# EasyEDA Pro project OSC1.eprj, schematic 主板电路

## Sheets
1 主板和AD: Create Date: 2024-10-10; Page Name: 主板和AD; Project Name: OSC1; Schematic Name: 主板电路; Update Date: 2024-10-10; Company: 嘉立创EDA; Page Size: A4; Version: V1.0
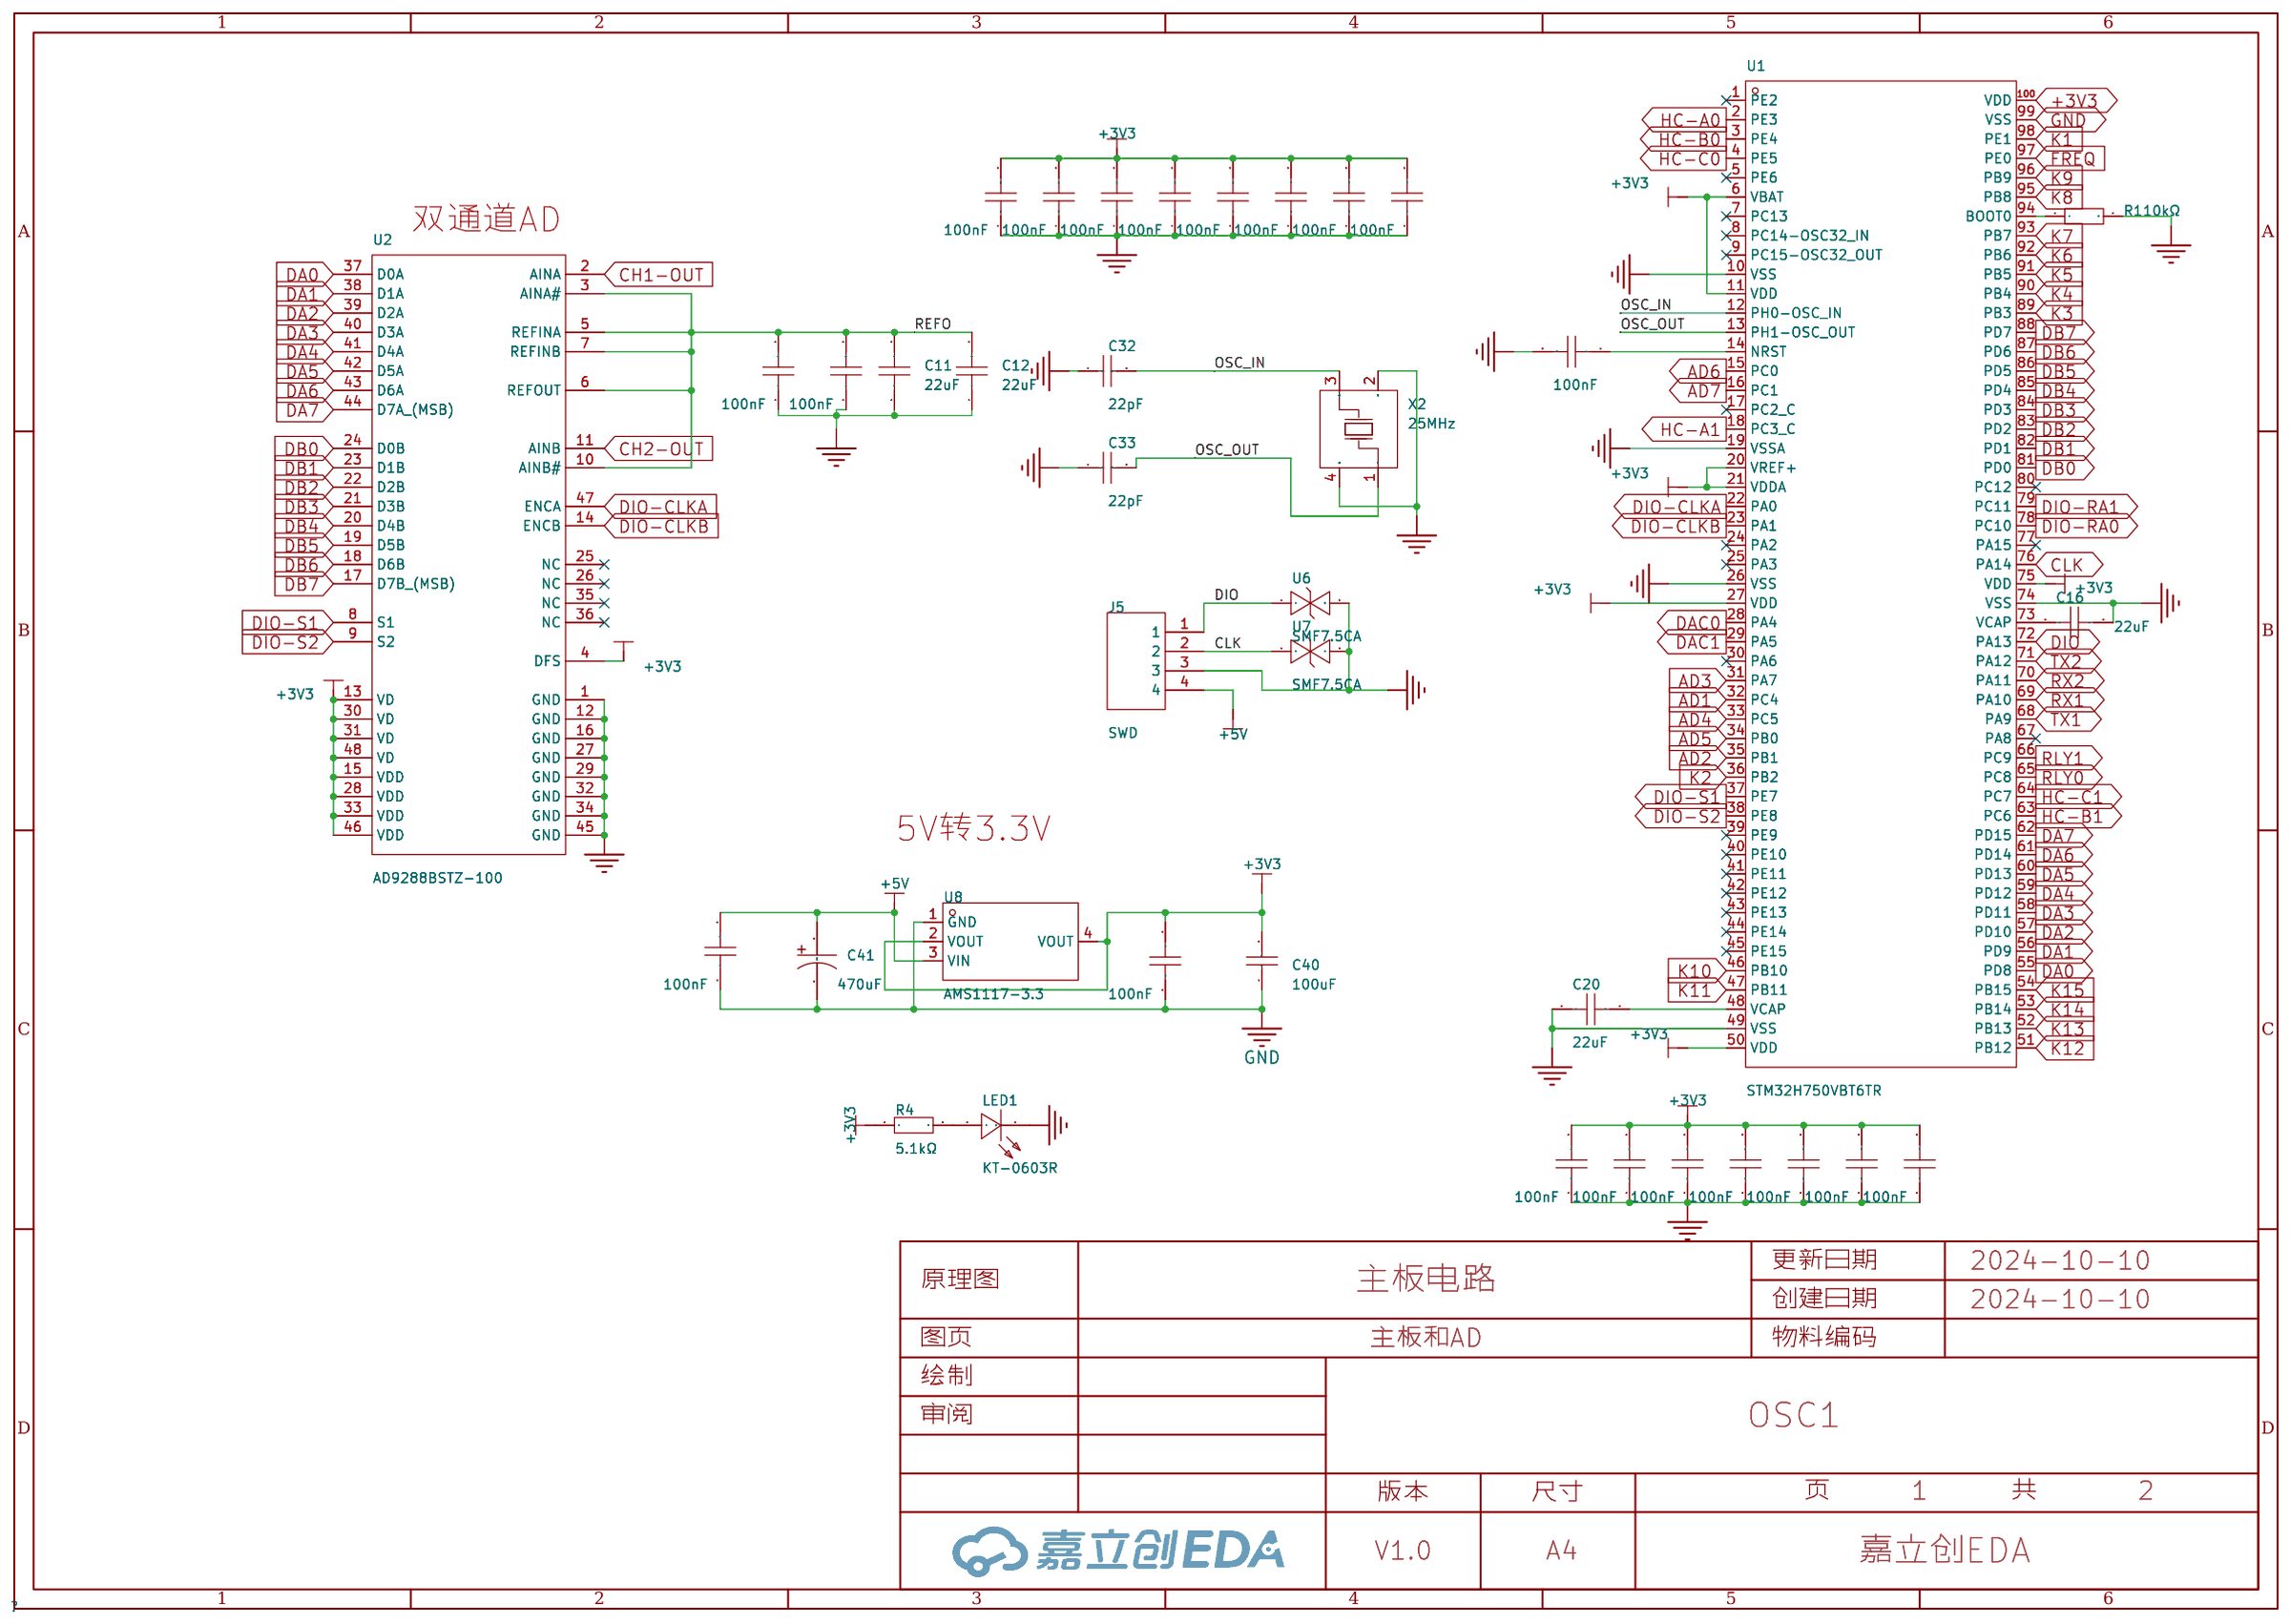
[diagram p4: 主板和AD]
2 插排: Page Name: 插排
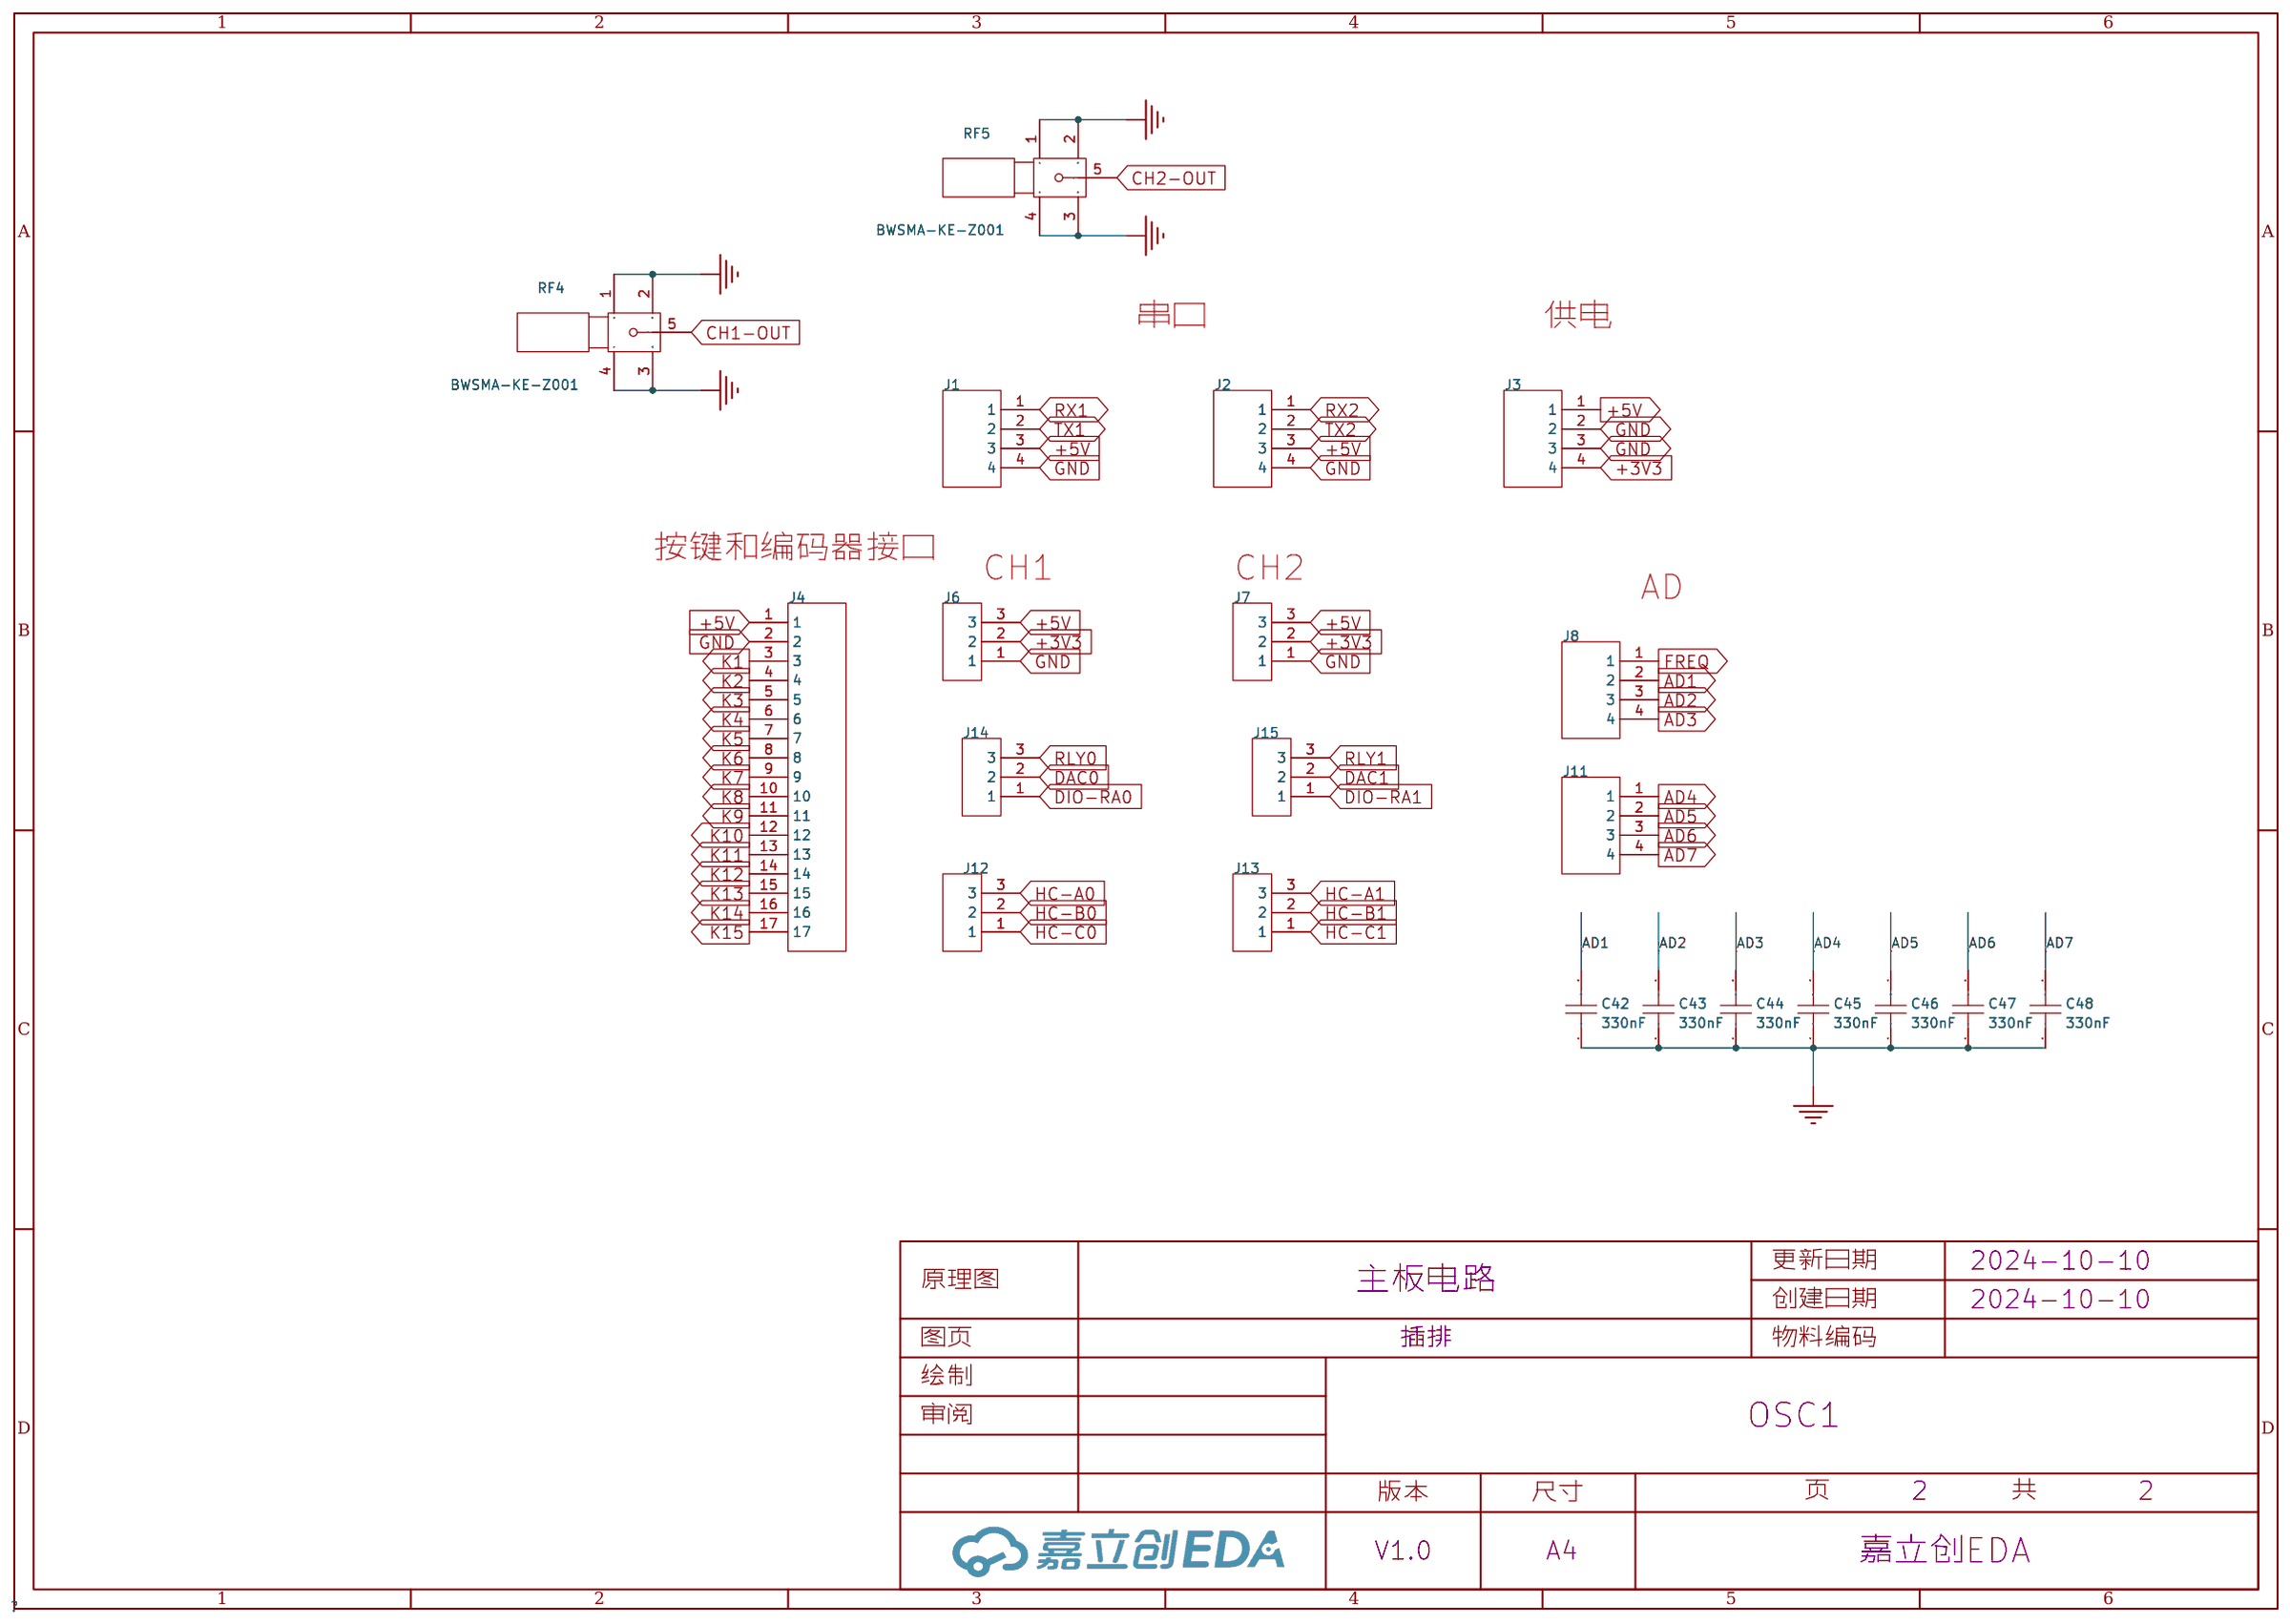
[diagram p5: 插排]

## Parts
sheet 主板和AD
C1  100nF  [C0402]
C2  100nF  [C0402]
C3  100nF  [C0402]
C4  100nF  [C0402]
C5  100nF  [C0402]
C6  100nF  [C0402]
C7  100nF  [C0402]
C8  100nF  [C0402]
C11  22uF  [C0603]
C12  22uF  [C0603]
C14  100nF  [C0402]
C16  22uF  [C0603]
C20  22uF  [C0603]
C21  100nF  [C0402]
C22  100nF  [C0402]
C23  100nF  [C0402]
C24  100nF  [C0402]
C25  100nF  [C0402]
C26  100nF  [C0402]
C27  100nF  [C0402]
C28  100nF  [C0402]
C29  100nF  [C0402]
C32  22pF  [C0603]
C33  22pF  [C0603]
C38  100nF  [C0402]
C39  100nF  [C0402]
C40  100uF  [C1206]
C41  470uF  [CAP-TH_BD8.0-P3.50-D0.6-FD_1]
J5  SWD  [CH2.54-4插座]
LED1  KT-0603R  [LED0603-RD]
R1  10kΩ  [R0402]
R4  5.1kΩ  [R0603]
U1  STM32H750VBT6TR  [QFP-100_L14.0-W14.0-P0.50-LS16.0-BL]
U2  AD9288BSTZ-100  [LQFP-48_L7.0-W7.0-P0.50-LS9.0-BL]
U6  SMF7.5CA  [SOD-123FL_L2.8-W1.8-LS3.7-BI]
U7  SMF7.5CA  [SOD-123FL_L2.8-W1.8-LS3.7-BI]
U8  AMS1117-3.3  [SOT-223-3_L6.5-W3.4-P2.30-LS7.0-BR]
X2  25MHz  [OSC-SMD_4P-L3.2-W2.5-BL]
sheet 插排
C42  330nF  [C0603]
C43  330nF  [C0603]
C44  330nF  [C0603]
C45  330nF  [C0603]
C46  330nF  [C0603]
C47  330nF  [C0603]
C48  330nF  [C0603]
J1  -  [CH2.54-4插座]
J2  -  [CH2.54-4插座]
J3  -  [CH2.54-4插座]
J4  -  [CH2.54-17P]
J6  -  [CH2.54-3插座]
J7  -  [CH2.54-3插座]
J8  -  [CH2.54-4插座]
J11  -  [CH2.54-4插座]
J12  -  [CH2.54-3插座]
J13  -  [CH2.54-3插座]
J14  -  [CH2.54-3插座]
J15  -  [CH2.54-3插座]
RF4  BWSMA-KE-Z001  [SMA-TH_BWSMA-KE-Z001]
RF5  BWSMA-KE-Z001  [SMA-TH_BWSMA-KE-Z001]

## Library data of the parts
C1-C8 C14 C21-C29 C38 C39 = CL05B104KB54PNC: 容值:100nF;精度:±10%;额定电压:50V;材质(温度系数):X7R;; LCSC Part Name: 100nF ±10% 50V; Supplier Part: C307331; Manufacturer: SAMSUNG(三星); Supplier Footprint: 0402; JLCPCB Part Class: 基础库; Datasheet: https://atta.szlcsc.com/upload/public/pdf/source/20160218/1457707763339.pdf; Supplier: LCSC; Tolerance: ±10%; Voltage Rated: 50V; Temperature Coefficient: X7R
C11 C12 C16 C20 = CL10A226MQ8NRNC: 容值:22uF;精度:±20%;额定电压:6.3V;材质(温度系数):X5R;; LCSC Part Name: 22uF ±20% 6.3V; Supplier Part: C59461; Manufacturer: SAMSUNG(三星); Supplier Footprint: 0603; Datasheet: https://atta.szlcsc.com/upload/public/pdf/source/20160218/1457707763339.pdf; Supplier: LCSC; Tolerance: ±20%; Voltage Rated: 6.3V; Temperature Coefficient: X5R
C32 C33 = CL10C220JB8NNNC: 容值:22pF;精度:±5%;额定电压:50V;材质(温度系数):C0G;; LCSC Part Name: 22pF ±5% 50V; Supplier Part: C1653; Manufacturer: SAMSUNG(三星); Supplier Footprint: 0603; JLCPCB Part Class: 基础库; Datasheet: https://atta.szlcsc.com/upload/public/pdf/source/20160218/1457707763339.pdf; Supplier: LCSC; Tolerance: ±5%; Voltage Rated: 50V; Temperature Coefficient: C0G
C40 = CL31A107MQHNNNE: 容值:100uF;精度:±20%;额定电压:6.3V;材质(温度系数):X5R;; LCSC Part Name: 100uF ±20% 6.3V; Supplier Part: C15008; Manufacturer: SAMSUNG(三星); Supplier Footprint: 1206; Datasheet: https://atta.szlcsc.com/upload/public/pdf/source/20160218/1457707763339.pdf; Supplier: LCSC; Tolerance: ±20%; Voltage Rated: 6.3V; Temperature Coefficient: X5R
C41 = RVT1A471M0607_C335982: 容值:470uF;精度:±20%;额定电压:10V;纹波电流:200mA@120Hz;等效串联电阻:-;; LCSC Part Name: 470uF ±20% 10V; Supplier Part: C335982; Manufacturer: ROQANG(容强); Manufacturer Part: RVT1A471M0607; Supplier Footprint: SMD,D6.3xL7.7mm; Datasheet: https://atta.szlcsc.com/upload/public/pdf/source/20181128/C335987_23CA7AA50FB42690DF736C43FE112376.pdf; Supplier: LCSC; Tolerance: ±20%; Rated Voltage: 10V; Ripple Current: 200mA@120Hz; φD: 6.3mm; L: 7.7mm; Lifetime @ Temp: 2000hrs@105℃; Operating Temperature: -40℃~+105℃
J1-J3 J5 J8 J11 = HDR-4P
LED1 = KT-0603R: 发光颜色:红色;功率:-;正向电流:-;主波长:-;二极管配置:-;透镜颜色:-;色温:-;发光角度:-;载带方式:-;工作温度:-40℃~+85℃;; LCSC Part Name: 0603 红灯 高亮; Supplier Part: C2286; Manufacturer: KENTO; Supplier Footprint: 0603; Datasheet: https://atta.szlcsc.com/upload/public/pdf/source/20160616/1466072038404.pdf; Supplier: LCSC; Emitted Color: 红色; Operating Temperature: -40℃~+85℃
R1 = 0402WGF1002TCE: 电阻类型:厚膜电阻;阻值:10kΩ;精度:±1%;功率:62.5mW;最大工作电压:50V;温度系数:±100ppm/℃;; LCSC Part Name: 10kΩ ±1% 62.5mW 厚膜电阻; Supplier Part: C25744; Manufacturer: UNI-ROYAL(厚声); Supplier Footprint: 0402; JLCPCB Part Class: 基础库; Datasheet: https://atta.szlcsc.com/upload/public/pdf/source/20200306/C422600_1E6D84923E4A46A82E41ADD87F860B5C.pdf; Supplier: LCSC; Type: 厚膜电阻; Tolerance: ±1%; Power(Watts): 62.5mW; Overload Voltage (Max): 50V; Temperature Coefficient: ±100ppm/℃; Operating Temperature Range: -55℃~+155℃
R4 = 0603WAF5101T5E: 电阻类型:厚膜电阻;阻值:5.1kΩ;精度:±1%;功率:100mW;最大工作电压:75V;温度系数:±100ppm/℃;; LCSC Part Name: 5.1kΩ ±1% 100mW 厚膜电阻; Supplier Part: C23186; Manufacturer: UNI-ROYAL(厚声); Supplier Footprint: 0603; Datasheet: https://atta.szlcsc.com/upload/public/pdf/source/20200306/C422600_1E6D84923E4A46A82E41ADD87F860B5C.pdf; Supplier: LCSC; Type: 厚膜电阻; Tolerance: ±1%; Power(Watts): 100mW; Overload Voltage (Max): 75V; Temperature Coefficient: ±100ppm/℃; Operating Temperature Range: -55℃~+155℃
U1 = STM32H750VBT6TR: CPU内核:-;程序存储容量:128KB;GPIO端口数量:82;工作电压范围:1.62V~3.6V;CPU最大主频:480MHz;; LCSC Part Name: 带DSP和DP-FPU的高性能ARM Cortex-M7 MCU，具有128 KB Flash、1 MB RAM、480 MHz CPU、一级缓存、外部存储器接口、JPEG编解码器、硬件加密和大量外设; Supplier Part: C2969869; Manufacturer: ST(意法半导体); Supplier Footprint: LQFP-100(14x14); JLCPCB Part Class: 扩展库; Datasheet: https://atta.szlcsc.com/upload/public/pdf/source/20210618/C1342741_481536973B33A4EFE007B1B46C2F1F11.pdf; Supplier: LCSC; Program Storage Size: 128KB; GPIO Ports Number: 82; Operating Voltage Range: 1.62V~3.6V; CPU Maximum Speed: 480MHz; Operating Temperature Range: -40℃~+85℃; ADC (Bit): 16bit; DAC (Bit): 12bit; Universal Serial Bus: 有; Watchdog: 有; Infrared Data Association: 有; Low-Voltage Detect: 有; LCD Module: 有; Secure Digital Input and Output: 有; Direct Memory Access: 有; Internal Oscillator: 有
U2 = AD9288BSTZ-100: 接口:并行;电源电压:2.7V~3.6V;采样率:100MHz;分辨率:8位;; Supplier Part: C31151; Manufacturer: ADI(亚德诺); Supplier Footprint: LQFP-48(7x7); JLCPCB Part Class: 扩展库; Datasheet: https://atta.szlcsc.com/upload/public/pdf/source/20140508/1457707057464.pdf; Supplier: LCSC; Interface: 并行; differential input: 是; number of channels: 2; Supply Voltage: 2.7V~3.6V; sampling frequency: 100MHz; resolution: 8位; Operating Temperature: -40℃~+85℃
U6 U7 = SMF7.5CA_C19077503: 极性:双向;反向截止电压(Vrwm):7.5V;最大钳位电压:12.9V;峰值脉冲电流(Ipp)@10/1000us:15.5A;峰值脉冲功率(Ppp)@10/1000us:200W;击穿电压:9.21V;; Supplier Part: C19077503; Manufacturer: 宏迦橙; Supplier Footprint: SOD-123FL; Datasheet: https://atta.szlcsc.com/upload/public/pdf/source/20231129/4813F17DC56F8B344A8D004597B3633C.pdf; Supplier: LCSC; polarity: 双向; Reverse Stand-Off Voltage (Vrwm): 7.5V; Maximum Clamping Voltage: 12.9V; Peak Pulse Current (Ipp)@10/1000us: 15.5A; Peak Pulse Power Dissipation (Ppp)@10/1000us: 200W; Breakdown Voltage: 9.21V; Reverse Leakage Current (Ir): 50uA; Operating Temperature: -55℃~+155℃; Type: TVS
U8 = AMS1117-3.3_C6186: 输出类型:固定;最大输入电压:-;输出电压:3.3V;最大输出电流:1A;电源纹波抑制比(PSRR):72dB@(120Hz);输出极性:正极;; LCSC Part Name: 输出3.3V 1A; Supplier Part: C6186; Manufacturer: AMS; Supplier Footprint: SOT-223; Datasheet: https://atta.szlcsc.com/upload/public/pdf/source/20180727/C6186_7A095716F0823C02F1997A905E26C086.pdf; Supplier: LCSC; Output Type: 固定; Output Voltage: 3.3V; MAX Output Current: 1A; Power Supply Rejection Ratio (PSRR): 72dB@(120Hz); Dropout Voltage: 1.3V@(800mA); Output Polarity: 正极; Number of Outputs: 1
X2 = X322525MOB4SI: 晶振类型:贴片晶振;频率:25MHz;常温频差:±10ppm;外接负载电容:12pF;频率稳定度(全温):±20ppm;; LCSC Part Name: 25MHz ±10ppm 12pF; Supplier Part: C9006; Manufacturer: YXC(扬兴晶振); Supplier Footprint: SMD3225-4P; Datasheet: https://atta.szlcsc.com/upload/public/pdf/source/20240329/19D5F850207469550BEB00D7DFEDBC7A.pdf; Supplier: LCSC; Crystal Type: 贴片晶振; Normal temperature Frequency Tolerance: ±10ppm; External load capacitor: 12pF; Frequency Stability(Full temperature range): ±20ppm; Operating Temperature: -40℃~+85℃
C42-C48 = FCC0603B334K500CT: 容值:330nF;精度:±10%;额定电压:50V;材质(温度系数):X7R;; LCSC Part Name: 330nF ±10% 50V; Supplier Part: C7419419; Manufacturer: FOJAN(富捷); Supplier Footprint: 0603; JLCPCB Part Class: 扩展库; Datasheet: https://atta.szlcsc.com/upload/public/pdf/source/20230926/96CBFEAC228090559554C216363F8731.pdf; Supplier: LCSC; Tolerance: ±10%; Voltage Rated: 50V; Temperature Coefficient: X7R
J4 = HDR-17P
J6 J7 J12-J15 = HDR-3P
RF4 RF5 = BWSMA-KE-Z001_C496549: 连接器类型:板端;接口类型:内孔;端口数量:1;接口直径:-;接口长度/高度:-;频率-最大值:-;射频系列:SMA;阻抗:50Ω;样式:正脚;触头材质:-;触头镀层:-;工作温度范围:-65℃~+165℃;焊接温度(最大值):-;; LCSC Part Name: 内孔 SMA 正脚; Supplier Part: C496549; Manufacturer: BAT WIRELESS(蝙蝠无线); Supplier Footprint: 插件; Datasheet: https://atta.szlcsc.com/upload/public/pdf/source/20221228/40BF41E56A06003A0210E1785CA66EA6.pdf; Supplier: LCSC; Connector Type: 板端; Interface Type: 内孔; Number of Ports: 1; RF Series: SMA; Impedance: 50Ω; Style: 正脚; Operating Temperature Range: -65℃~+165℃

## Nets
+3V3: C1.2 C2.2 C3.2 C4.2 C5.2 C6.2 C7.2 C8.2 C21.2 C22.2 C23.2 C24.2 C25.2 C26.2 C27.2 C39.2 C40.2 J3.4 J6.2 J7.2 R4.1 U1.6(VBAT) U1.11(VDD) U1.20(VREF+) U1.21(VDDA) U1.27(VDD) U1.50(VDD) U1.75(VDD) U1.100(VDD) U2.4(DFS) U2.13(VD) U2.15(VDD) U2.28(VDD) U2.30(VD) U2.31(VD) U2.33(VDD) U2.46(VDD) U2.48(VD) U8.2(VOUT) U8.4(VOUT)
+5V: C38.2 C41.1 J1.3 J2.3 J3.1 J4.1 J5.4 J6.3 J7.3 U8.3(VIN)
GND: C1.1 C2.1 C3.1 C4.1 C5.1 C6.1 C7.1 C8.1 C11.1 C12.1 C14.2 C16.1 C20.2 C21.1 C22.1 C23.1 C24.1 C25.1 C26.1 C27.1 C28.1 C29.1 C32.1 C33.1 C38.1 C39.1 C40.1 C41.2 C42.1 C43.1 C44.1 C45.1 C46.1 C47.1 C48.1 J1.4 J2.4 J3.2 J3.3 J4.2 J5.3 J6.1 J7.1 LED1.1(K) R1.2 RF4.1 RF4.2 RF4.3 RF4.4 RF5.1 RF5.2 RF5.3 RF5.4 U1.10(VSS) U1.19(VSSA) U1.26(VSS) U1.49(VSS) U1.74(VSS) U1.99(VSS) U2.1(GND) U2.12(GND) U2.16(GND) U2.27(GND) U2.29(GND) U2.32(GND) U2.34(GND) U2.45(GND) U6.2 U7.2 U8.1(GND) X2.2(GND) X2.4(GND)
AD1: C42.2 J8.2 U1.32(PC4)
AD2: C43.2 J8.3 U1.35(PB1)
AD3: C44.2 J8.4 U1.31(PA7)
AD4: C45.2 J11.1 U1.33(PC5)
AD5: C46.2 J11.2 U1.34(PB0)
AD6: C47.2 J11.3 U1.15(PC0)
AD7: C48.2 J11.4 U1.16(PC1)
CH1-OUT: RF4.5 U2.2(AINA)
CH2-OUT: RF5.5 U2.11(AINB)
CLK: J5.2 U1.76(PA14) U7.1
DA0: U1.55(PD8) U2.37(D0A)
DA1: U1.56(PD9) U2.38(D1A)
DA2: U1.57(PD10) U2.39(D2A)
DA3: U1.58(PD11) U2.40(D3A)
DA4: U1.59(PD12) U2.41(D4A)
DA5: U1.60(PD13) U2.42(D5A)
DA6: U1.61(PD14) U2.43(D6A)
DA7: U1.62(PD15) U2.44(D7A (MSB))
DAC0: J14.2 U1.28(PA4)
DAC1: J15.2 U1.29(PA5)
DB0: U1.81(PD0) U2.24(D0B)
DB1: U1.82(PD1) U2.23(D1B)
DB2: U1.83(PD2) U2.22(D2B)
DB3: U1.84(PD3) U2.21(D3B)
DB4: U1.85(PD4) U2.20(D4B)
DB5: U1.86(PD5) U2.19(D5B)
DB6: U1.87(PD6) U2.18(D6B)
DB7: U1.88(PD7) U2.17(D7B (MSB))
DIO: J5.1 U1.72(PA13) U6.1
DIO-CLKA: U1.22(PA0) U2.47(ENCA)
DIO-CLKB: U1.23(PA1) U2.14(ENCB)
DIO-RA0: J14.1 U1.78(PC10)
DIO-RA1: J15.1 U1.79(PC11)
DIO-S1: U1.37(PE7) U2.8(S1)
DIO-S2: U1.38(PE8) U2.9(S2)
FREQ: J8.1 U1.97(PE0)
HC-A0: J12.3 U1.2(PE3)
HC-A1: J13.3 U1.18(PC3_C)
HC-B0: J12.2 U1.3(PE4)
HC-B1: J13.2 U1.63(PC6)
HC-C0: J12.1 U1.4(PE5)
HC-C1: J13.1 U1.64(PC7)
K1: J4.3 U1.98(PE1)
K2: J4.4 U1.36(PB2)
K3: J4.5 U1.89(PB3)
K4: J4.6 U1.90(PB4)
K5: J4.7 U1.91(PB5)
K6: J4.8 U1.92(PB6)
K7: J4.9 U1.93(PB7)
K8: J4.10 U1.95(PB8)
K9: J4.11 U1.96(PB9)
K10: J4.12 U1.46(PB10)
K11: J4.13 U1.47(PB11)
K12: J4.14 U1.51(PB12)
K13: J4.15 U1.52(PB13)
K14: J4.16 U1.53(PB14)
K15: J4.17 U1.54(PB15)
OSC_IN: C32.2 U1.12(PH0-OSC_IN) X2.3(OSC2)
OSC_OUT: C33.2 U1.13(PH1-OSC_OUT) X2.1(OSC1)
REFO: C11.2 C12.2 C28.2 C29.2 U2.3(AINA#) U2.5(REFINA) U2.6(REFOUT) U2.7(REFINB) U2.10(AINB#)
RLY0: J14.3 U1.65(PC8)
RLY1: J15.3 U1.66(PC9)
RX1: J1.1 U1.69(PA10)
RX2: J2.1 U1.70(PA11)
TX1: J1.2 U1.68(PA9)
TX2: J2.2 U1.71(PA12)
$1N7062: C14.1 U1.14(NRST)
$1N7469: C20.1 U1.48(VCAP)
$1N8680: R1.1 U1.94(BOOT0)
$1N14131: C16.2 U1.73(VCAP)
$1N14803: LED1.2(A) R4.2

Not connected (* = marked no-connect by the designer): U1 1(PE2)* 5(PE6)* 7(PC13)* 8(PC14-OSC32_IN)* 9(PC15-OSC32_OUT)* 17(PC2_C)* 24(PA2)* 25(PA3)* 30(PA6)* 39(PE9)* 40(PE10)* 41(PE11)* 42(PE12)* 43(PE13)* 44(PE14)* 45(PE15)* 67(PA8)* 77(PA15)* 80(PC12)*; U2 25(NC)* 26(NC)* 35(NC)* 36(NC)*

## Notes on the sheets
sheet 1
- 双通道AD
- 5V转3.3V
sheet 2
- 串口
- 供电
- 按键和编码器接口
- CH1
- CH2
- AD
